# Altium schematic sheet DAC Module Interface.SchDoc
size A3; Date: 27.05.2014; DrawnBy: Author; Organization: BFH; Address1: Bern University of Applied Sciences; Address2: Engineering and Information Technology; Address3: Jlcoweg 1; Address4: CH-3400 Burgdorf; DocumentNumber: 1; Revision: 1.1; SheetNumber: 2; SheetTotal: 3; CurrentDate: 27.05.2014
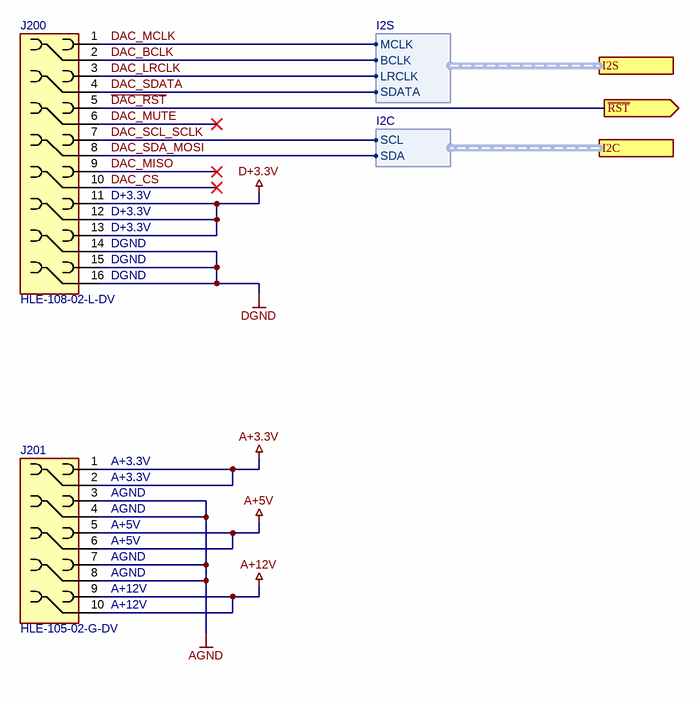
[diagram p0: DAC Module Interface.SchDoc]

## Parts
J200  HLE-108-02-L-DV  [HLE-108-02-XXX-DV-A]
J201  HLE-105-02-G-DV  [HLE-105-02-XXX-DV-A]

## Ports
I2C (harness I2C), I2S (harness I2S), ~{RST} (out)

## Harnesses
I2C: SCL, SDA
I2S: MCLK, BCLK, LRCLK, SDATA

## Nets
A+3.3V: J201.1 J201.2
A+5V: J201.5 J201.6
A+12V: J201.9 J201.10
AGND: J201.3 J201.4 J201.7 J201.8
D+3.3V: J200.11 J200.12 J200.13
DGND: J200.14 J200.15 J200.16
~{DAC_RST}: J200.5 ; port ~{RST}
DAC_BCLK: J200.2 ; port I2S.BCLK
DAC_CS: J200.10
DAC_LRCLK: J200.3 ; port I2S.LRCLK
DAC_MCLK: J200.1 ; port I2S.MCLK
DAC_MISO: J200.9
DAC_MUTE: J200.6
DAC_SCL_SCLK: J200.7 ; port I2C.SCL
DAC_SDA_MOSI: J200.8 ; port I2C.SDA
DAC_SDATA: J200.4 ; port I2S.SDATA

## Notes on the sheet
- (near J200) D+3.3V
- (near J200) DGND
- (near J201) A+3.3V
- (near J201) AGND
- (near J201) A+5V
- (near J201) A+12V
- Project:
- Size:
- Sheet:
- Title:
- A3
- of
- Drawn by:
- Revision:
- Date:
- Variant:
- b
- File:

## Library data of the parts
J200 = Receptacle 8x2P: Receptacle 5x2P; Manufacturer Part No.: HLE-108-02-L-DV
J201 = Receptacle 5x2P: Manufacturer Part No.: HLE-105-02-G-DV